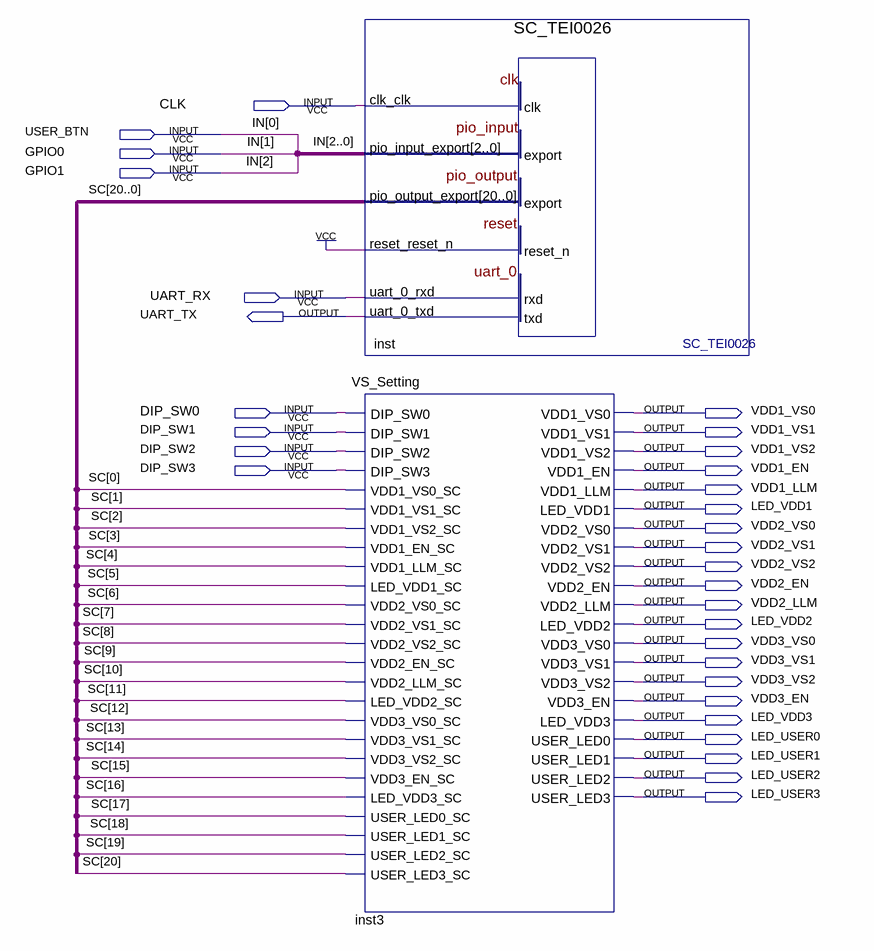
[diagram p0: schematic sheet]
// Quartus schematic TEI0026.bdf as structural Verilog: 2 symbols, 31 pins
module TEI0026 (
  input  CLK,
  input  USER_BTN,
  input  GPIO0,
  input  GPIO1,
  input  UART_RX,
  input  DIP_SW0,
  input  DIP_SW1,
  input  DIP_SW2,
  input  DIP_SW3,
  output UART_TX,
  output VDD1_VS0,
  output VDD1_VS1,
  output VDD1_VS2,
  output VDD1_EN,
  output VDD1_LLM,
  output LED_VDD1,
  output VDD2_VS0,
  output VDD2_VS1,
  output VDD2_VS2,
  output VDD2_EN,
  output VDD2_LLM,
  output LED_VDD2,
  output VDD3_VS0,
  output VDD3_VS1,
  output VDD3_VS2,
  output VDD3_EN,
  output LED_VDD3,
  output LED_USER0,
  output LED_USER1,
  output LED_USER2,
  output LED_USER3
);

  wire [20:0] SC;

  SC_TEI0026 inst (
    .clk_clk(CLK), .pio_input_export({GPIO1, GPIO0, USER_BTN}), .reset_reset_n(1'b1), .uart_0_rxd(UART_RX),
    .pio_output_export(SC), .uart_0_txd(UART_TX));
  VS_Setting inst3 (
    .DIP_SW0(DIP_SW0), .DIP_SW1(DIP_SW1), .DIP_SW2(DIP_SW2), .DIP_SW3(DIP_SW3), .VDD1_VS0_SC(SC[0]),
    .VDD1_VS1_SC(SC[1]), .VDD1_VS2_SC(SC[2]), .VDD1_EN_SC(SC[3]), .VDD1_LLM_SC(SC[4]), .LED_VDD1_SC(SC[5]),
    .VDD2_VS0_SC(SC[6]), .VDD2_VS1_SC(SC[7]), .VDD2_VS2_SC(SC[8]), .VDD2_EN_SC(SC[9]), .VDD2_LLM_SC(SC[10]),
    .LED_VDD2_SC(SC[11]), .VDD3_VS0_SC(SC[12]), .VDD3_VS1_SC(SC[13]), .VDD3_VS2_SC(SC[14]),
    .VDD3_EN_SC(SC[15]), .LED_VDD3_SC(SC[16]), .USER_LED0_SC(SC[17]), .USER_LED1_SC(SC[18]),
    .USER_LED2_SC(SC[19]), .USER_LED3_SC(SC[20]), .VDD1_VS0(VDD1_VS0), .VDD1_VS1(VDD1_VS1),
    .VDD1_VS2(VDD1_VS2), .VDD1_EN(VDD1_EN), .VDD1_LLM(VDD1_LLM), .LED_VDD1(LED_VDD1), .VDD2_VS0(VDD2_VS0),
    .VDD2_VS1(VDD2_VS1), .VDD2_VS2(VDD2_VS2), .VDD2_EN(VDD2_EN), .VDD2_LLM(VDD2_LLM), .LED_VDD2(LED_VDD2),
    .VDD3_VS0(VDD3_VS0), .VDD3_VS1(VDD3_VS1), .VDD3_VS2(VDD3_VS2), .VDD3_EN(VDD3_EN), .LED_VDD3(LED_VDD3),
    .USER_LED0(LED_USER0), .USER_LED1(LED_USER1), .USER_LED2(LED_USER2), .USER_LED3(LED_USER3));

  // Other names for the same wires on the sheet: IN[2:0] = {GPIO1, GPIO0, USER_BTN}
endmodule
